# EAGLE design T04_Main_Board (EAGLE 7.1.0)
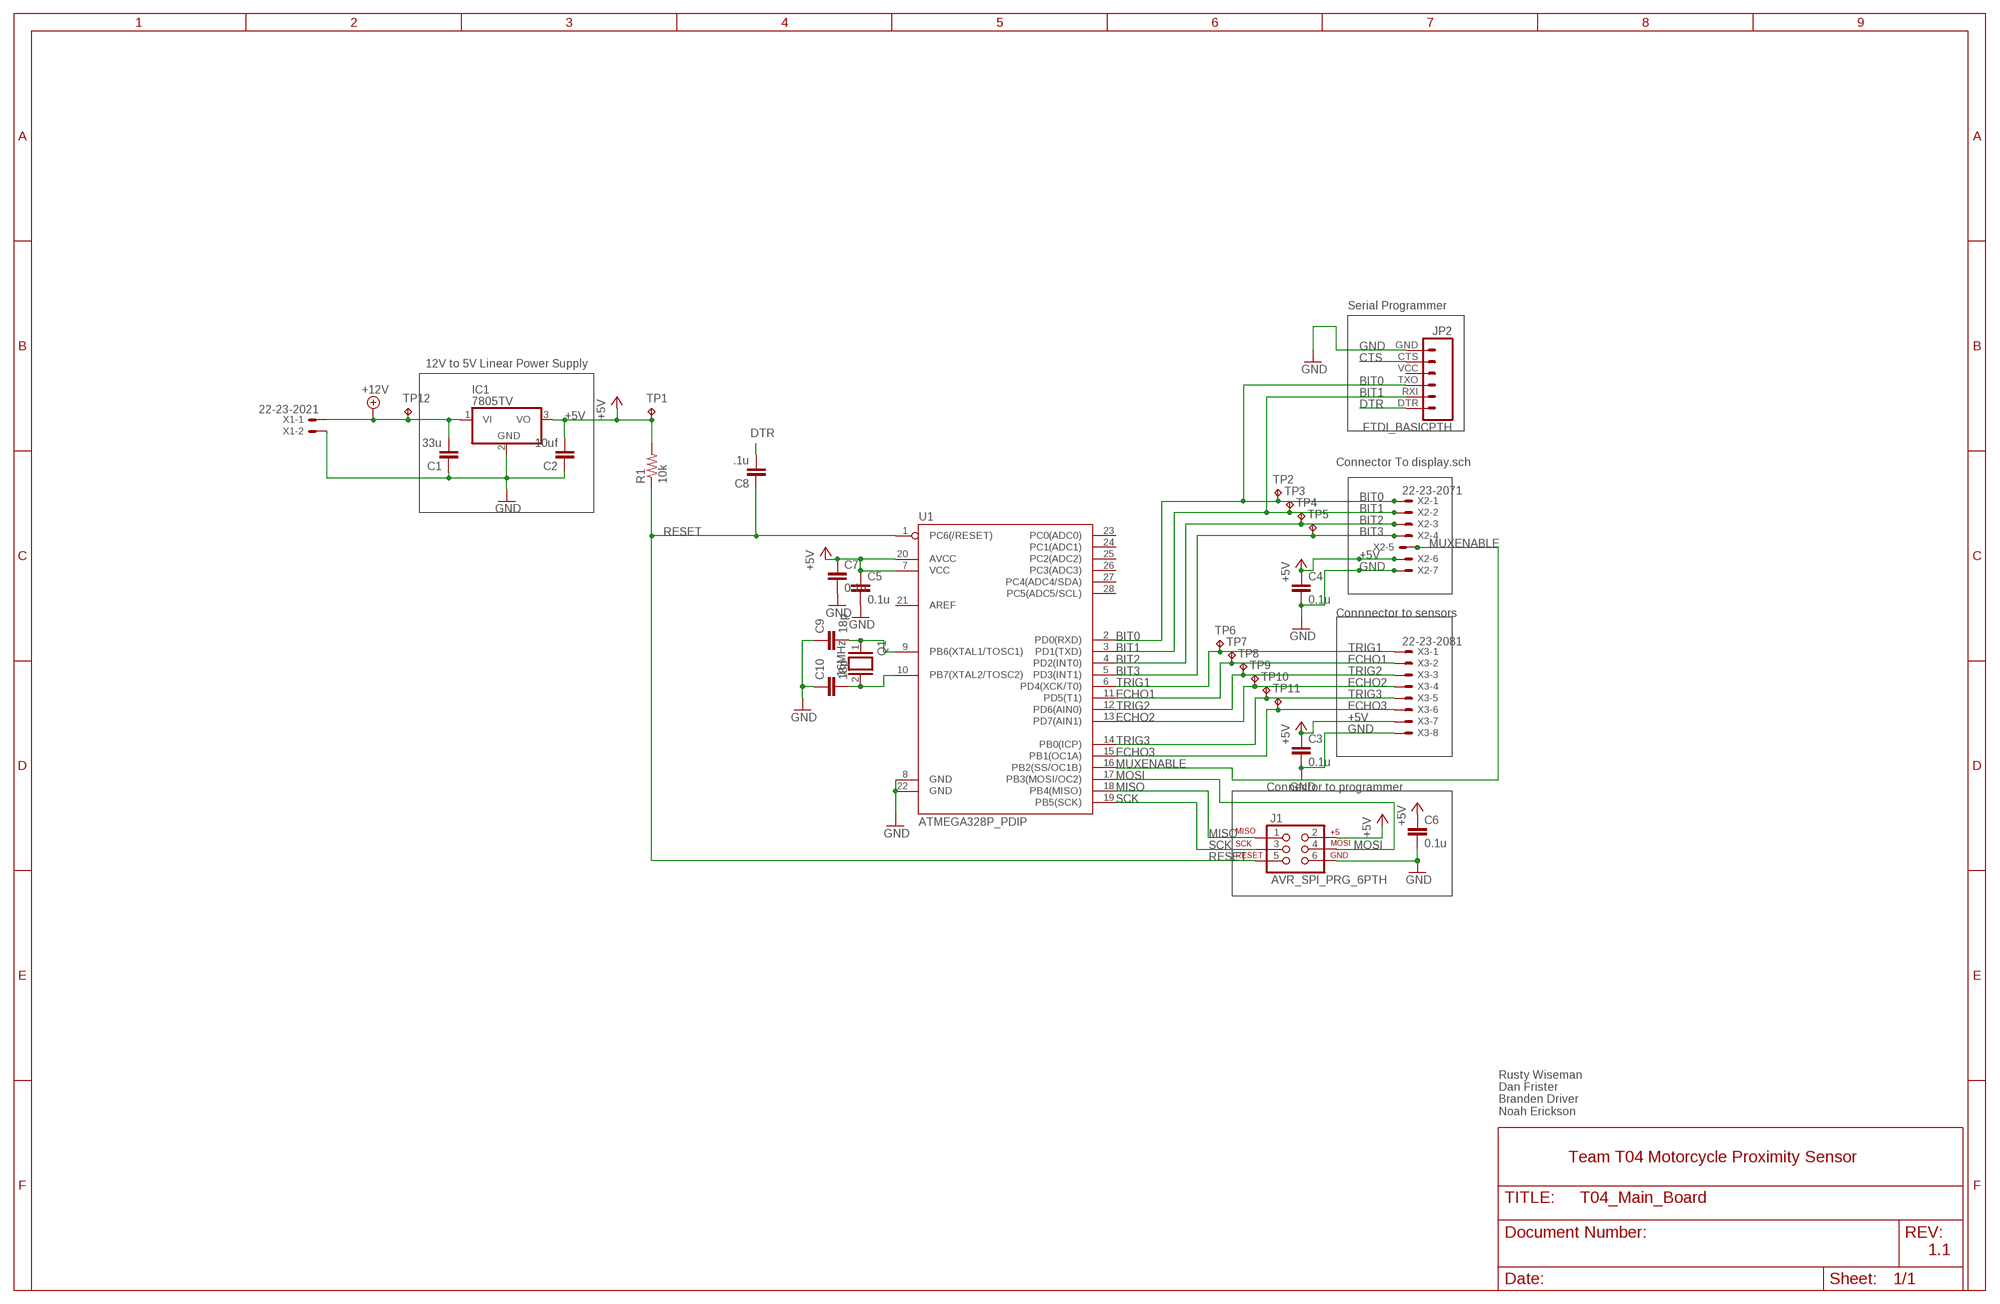
[diagram p0: schematic, sheet 1]

## Parts
C1  33u  C-EUC1206  [C1206]
C2  10uf  C-EUC1206  [C1206]
C3  0.1u  C-EUC1206  [C1206]
C4  0.1u  C-EUC1206  [C1206]
C5  0.1u  C-EUC1206  [C1206]
C6  0.1u  C-EUC1206  [C1206]
C7  0.1u  C-EUC1206  [C1206]
C8  .1u  C-EUC1206  [C1206]
C9  18p  C-EUC1206  [C1206]
C10  18p  C-EUC1206  [C1206]
IC1  7805TV  [TO220V]
J1  AVR_SPI_PRG_6PTH  [2X3]
JP2  FTDI_BASICPTH  [FTDI_BASIC]
Q1  16MHz  XTAL/S  [QS]
R1  10k  R-US_R1206  [R1206]
TP1  TPB1,27  [B1,27]
TP2  TPB1,27  [B1,27]
TP3  TPB1,27  [B1,27]
TP4  TPB1,27  [B1,27]
TP5  TPB1,27  [B1,27]
TP6  TPB1,27  [B1,27]
TP7  TPB1,27  [B1,27]
TP8  TPB1,27  [B1,27]
TP9  TPB1,27  [B1,27]
TP10  TPB1,27  [B1,27]
TP11  TPB1,27  [B1,27]
TP12  TPB1,27  [B1,27]
U1  ATMEGA328P_PDIP  [DIL28-3]
X1  22-23-2021  [22-23-2021]
X2  22-23-2071  [22-23-2071]
X3  22-23-2081  [22-23-2081]

## Nets
+5V: C2.2 C3.1 C4.1 C5.1 C6.1 C7.1 IC1.3(VO) J1.2 R1.2 TP1.TP U1.7(VCC) U1.20(AVCC) X2.6 X3.7
+12V: C1.2 IC1.1(VI) TP12.TP X1.1
BIT0: JP2.TXO TP2.TP U1.2(PD0(RXD)) X2.1
BIT1: JP2.RXI TP3.TP U1.3(PD1(TXD)) X2.2
BIT2: TP4.TP U1.4(PD2(INT0)) X2.3
BIT3: TP5.TP U1.5(PD3(INT1)) X2.4
CTS: JP2.CTS
DTR: C8.2 JP2.DTR
ECHO1: TP7.TP U1.11(PD5(T1)) X3.2
ECHO2: TP9.TP U1.13(PD7(AIN1)) X3.4
ECHO3: TP11.TP U1.15(PB1(OC1A)) X3.6
GND: C1.1 C2.1 C3.2 C4.2 C5.2 C6.2 C7.2 C9.1 C10.1 IC1.2(GND) J1.6 JP2.GND U1.8(GND) U1.22(GND) X1.2 X2.7 X3.8
MISO: J1.1 U1.18(PB4(MISO))
MOSI: J1.4 U1.17(PB3(MOSI/OC2))
MUXENABLE: U1.16(PB2(SS/OC1B)) X2.5
N$2: C10.2 Q1.2 U1.10(PB7(XTAL2/TOSC2))
N$3: C9.2 Q1.1 U1.9(PB6(XTAL1/TOSC1))
RESET: C8.1 J1.5 R1.1 U1.1(PC6(/RESET))
SCK: J1.3 U1.19(PB5(SCK))
TRIG1: TP6.TP U1.6(PD4(XCK/T0)) X3.1
TRIG2: TP8.TP U1.12(PD6(AIN0)) X3.3
TRIG3: TP10.TP U1.14(PB0(ICP)) X3.5
Unconnected: JP2.VCC U1.21(AREF) U1.23(PC0(ADC0)) U1.24(PC1(ADC1)) U1.25(PC2(ADC2)) U1.26(PC3(ADC3)) U1.27(PC4(ADC4/SDA)) U1.28(PC5(ADC5/SCL))

## Notes on the sheet
- Serial Programmer
- 12V to 5V Linear Power Supply
- Connector To display.sch
- Connnector to sensors
- Connector to programmer
- Rusty Wiseman
  Dan Frister
  Branden Driver
  Noah Erickson
- Team T04 Motorcycle Proximity Sensor
- 1.1

## Library data of the parts
C1-C10 = rcl:C-EU: CAPACITOR, European symbol
IC1 = linear:78*: Positive VOLTAGE REGULATOR Source: http://cache.national.com/ds/LM/LM78L05.pdf http://www.fairchildsemi.com/ds/LM/LM7805.pdf
J1 = SparkFun-Connectors:AVR_SPI_PRG_6: AVR ISP 6 Pin This is the reduced ISP connector for AVR programming. Common on Arduino. This footprint will take up less PCB space and can be used with a 10-pin to 6-pin adapter such as SKU: BOB-08508 **Special note about "TEST_POINT" package. The stop mask is on the top side, so if you want your programming test points to be on the bottom of your board, make sure to place this package on the bottom side of the board. This also ensure that the orientation to program from the bottom side will be correct.
JP2 = SparkFun-Connectors:FTDI_BASIC: FTDI Basic header with labels
Q1 = special:XTAL/S: CRYSTAL
R1 = rcl:R-US_: RESISTOR, American symbol
TP1-TP12 = testpad:TP: Test pad
U1 = SparkFun-DigitalIC:ATMEGA328P_PDIP: uC used in the Arduino 32kb flash, 1k EEPROM, 2k SRAM This is the through-hole version of this chip.
X1 = con-molex:22-23-2021: .100" (2.54mm) Center Header - 2 Pin; MF: MOLEX; MPN: 22-23-2021; OC_FARNELL: 1462926; OC_NEWARK: 25C3832
X2 = con-molex:22-23-2071: .100" (2.54mm) Center Header - 7 Pin; MF: MOLEX; MPN: 22-23-2071; OC_FARNELL: 1654534; OC_NEWARK: 56H0445
X3 = con-molex:22-23-2081: .100" (2.54mm) Center Header - 8 Pin; MF: MOLEX; MPN: 22-23-2081; OC_FARNELL: 1756826; OC_NEWARK: 01C7592

## Board
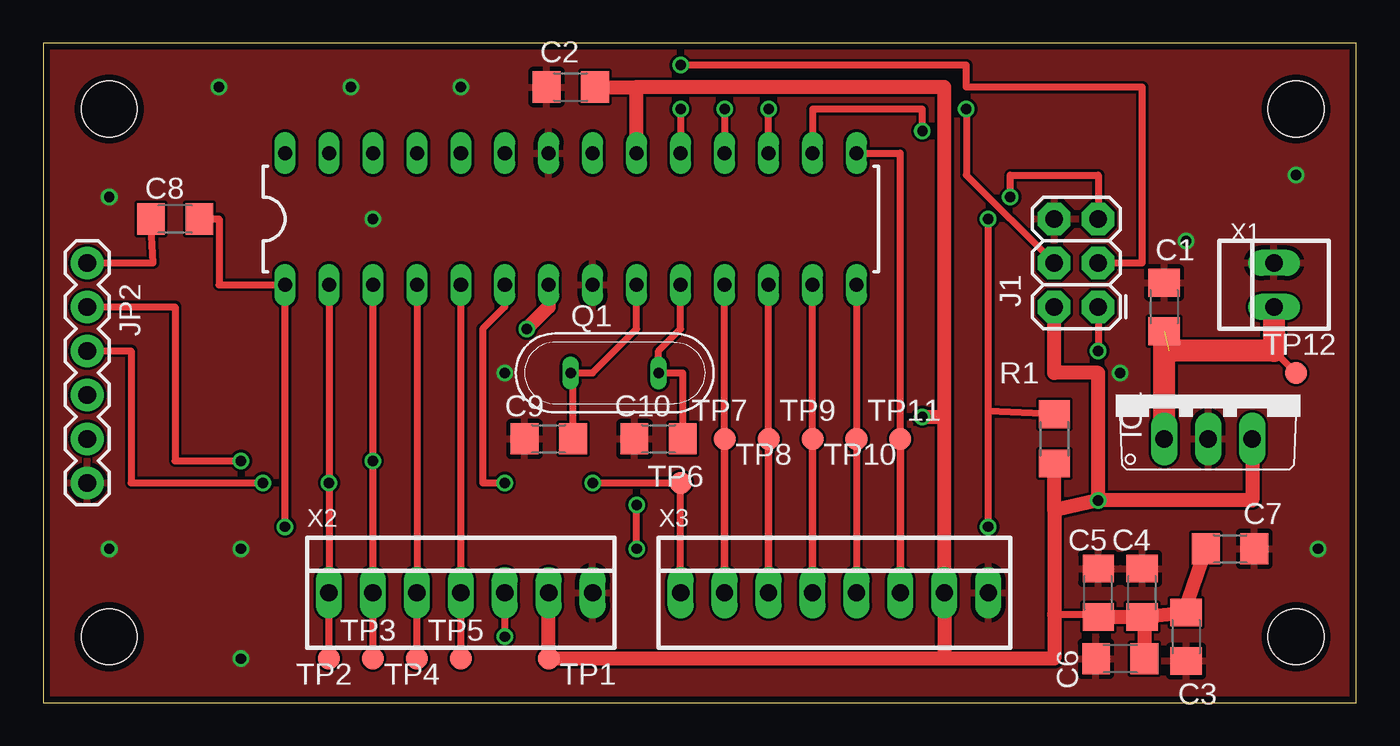
[diagram p1: board, top side]
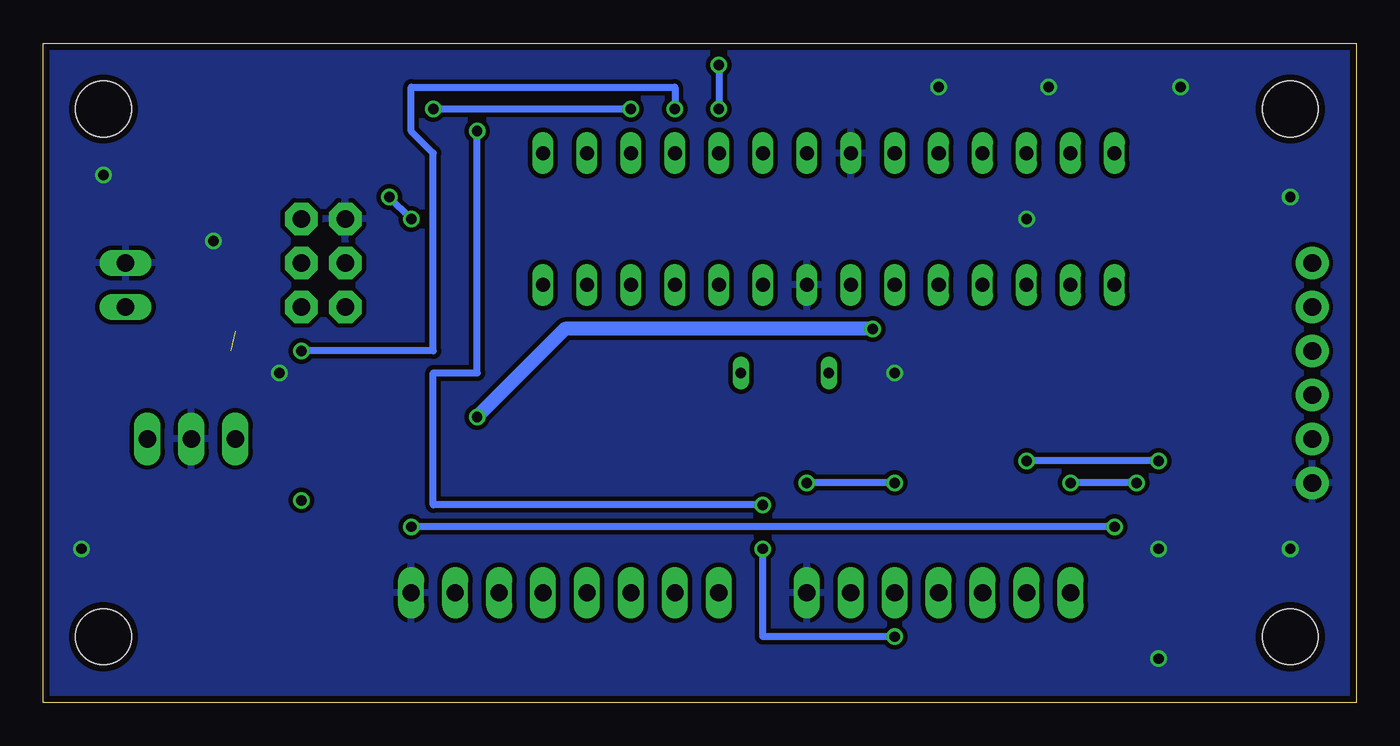
[diagram p2: board, bottom side, seen from below]

Size 75.87 x 38.09 mm. Coordinates in mm from the lower left corner, seen from the top.
Outline: 0,0 75.87,0 75.87,38.09 0,38.09 0,0
Copper layers (1*16): Top 0.0356mm / dielectric 1.5011mm / Bottom 0.0356mm
Design rules "OSH-Park-2-layer": minimum track width 6mil, minimum drill 13mil, track to track 6mil, track to pad 6mil, pad to pad 6mil, via to via 6mil, smd to smd 6mil, copper to edge 15mil, drill to drill 6mil, minimum pad ring 7mil, minimum via ring 7mil, stop-mask expansion 3mil, vias tented up to drill 0mil, thermal gap 10mil
Holes 3.2 mm at 3.81,3.81 72.39,3.81 72.39,34.29 3.81,34.29

### Footprints (pad centres in the part's own frame; a part is rotated, then mirrored left to right if it is on the bottom)
C1206 = smd 1.6 x 1.8: 1 -1.4,0; 2 1.4,0
TO220V = drill 1.016 long: 1 -2.54,-2.54; 2 0,-2.54; 3 2.54,-2.54
2X3 = drill 1.016 pad 1.88 octagon: 1 0,0; 2 0,2.54; 3 2.54,0; 4 2.54,2.54; 5 5.08,0; 6 5.08,2.54
FTDI_BASIC = drill 1.016 pad 1.88: CTS 10.16,0; DTR 0,0; GND 12.7,0; RXI 2.54,0; TXO 5.08,0; VCC 7.62,0
QS = drill 0.61 long: 1 -2.54,0; 2 2.54,0
R1206 = smd 1.6 x 1.803: 1 -1.422,0; 2 1.422,0
B1,27 = smd 1.27 x 1.27: TP 0,0
DIL28-3 = drill 0.813 long: 1 -16.51,-3.81; 2 -13.97,-3.81; 3 -11.43,-3.81; 4 -8.89,-3.81; 5 -6.35,-3.81; 6 -3.81,-3.81; 7 -1.27,-3.81; 8 1.27,-3.81; 9 3.81,-3.81; 10 6.35,-3.81; 11 8.89,-3.81; 12 11.43,-3.81; 13 13.97,-3.81; 14 16.51,-3.81; 15 16.51,3.81; 16 13.97,3.81; 17 11.43,3.81; 18 8.89,3.81; 19 6.35,3.81; 20 3.81,3.81; 21 1.27,3.81; 22 -1.27,3.81; 23 -3.81,3.81; 24 -6.35,3.81; 25 -8.89,3.81; 26 -11.43,3.81; 27 -13.97,3.81; 28 -16.51,3.81
22-23-2021 = drill 1 long: 1 -1.27,0; 2 1.27,0
22-23-2071 = drill 1 long: 1 -7.62,0; 2 -5.08,0; 3 -2.54,0; 4 0,0; 5 2.54,0; 6 5.08,0; 7 7.62,0
22-23-2081 = drill 1 long: 1 -8.89,0; 2 -6.35,0; 3 -3.81,0; 4 -1.27,0; 5 1.27,0; 6 3.81,0; 7 6.35,0; 8 8.89,0

### Placement (x,y rotation side)
C1  64.77,22.86 270 top
C2  30.48,35.56 0 top
C3  66.04,3.81 270 top
C4  63.5,6.35 90 top
C5  60.96,6.35 90 top
C6  62.23,2.54 180 top
C7  68.58,8.89 0 top
C8  7.62,27.94 180 top
C9  29.21,15.24 0 top
C10  35.56,15.24 0 top
IC1  67.31,17.78 0 top
J1  60.96,22.86 90 top
JP2  2.54,25.4 270 top
Q1  33.02,19.05 0 top
R1  58.42,15.24 270 top
TP1  29.21,2.54 0 top
TP2  16.51,2.54 0 top
TP3  19.05,2.54 0 top
TP4  21.59,2.54 0 top
TP5  24.13,2.54 0 top
TP6  36.83,12.7 0 top
TP7  39.37,15.24 0 top
TP8  41.91,15.24 0 top
TP9  44.45,15.24 0 top
TP10  46.99,15.24 0 top
TP11  49.53,15.24 0 top
TP12  72.39,19.05 0 top
U1  30.48,27.94 0 top
X1  71.12,24.13 90 top
X2  24.13,6.35 0 top
X3  45.72,6.35 0 top

### Tracks (layer width: path | path; a pad name or v marks a point on that pad's centre or on a via)
+5V  (via drill 0.6)
  Top 0.406: C5.1 60.96,5.08 58.42,5.08 | 65.91,5.21 C3.1
  Top 0.813: IC1.3 69.85,11.69 v60.96,11.69 | 52.07,16.51 X3.7 52.07,2.54 | 52.07,16.51 52.07,35.56 34.29,35.56 | v60.96,11.69 60.96,19.05 58.42,19.05 J1.2 | X2.6 TP1.TP 52.07,2.54 | 58.42,11.12 58.42,5.08 58.42,2.54 52.07,2.54 | U1.20 34.29,35.56 | U1.7 29.21,22.86 v27.94,21.59 | v50.8,16.51 52.07,16.51 | v60.96,11.69 58.42,11.12 | 58.42,11.12 R1.2 | C5.1 C4.1 63.63,4.95 | 63.63,4.95 C6.1 | 63.63,4.95 C3.1 | C7.1 65.91,5.21 | C2.2 34.29,35.56
  Bottom 0.813: v27.94,21.59 45.72,21.59 v50.8,16.51
+12V  (1 unrouted)
  Top 0.406: 71.12,20.32 TP12.TP
  Top 1.27: X1.1 71.12,20.32 65.05,20.32 | IC1.1 C1.2
BIT0  (via drill 0.6)
  Top 0.406: TP2.TP X2.1 v16.51,12.7 U1.2 | JP2.TXO 5.08,20.32 5.08,12.7 v12.7,12.7
  Bottom 0.406: v12.7,12.7 v16.51,12.7
BIT1  (via drill 0.6)
  Top 0.406: TP3.TP X2.2 v19.05,13.97 U1.3 | JP2.RXI 7.62,22.86 7.62,13.97 v11.43,13.97
  Bottom 0.406: v11.43,13.97 v19.05,13.97
BIT2
  Top 0.406: U1.4 X2.3 TP4.TP
BIT3
  Top 0.406: U1.5 X2.4 TP5.TP
DTR
  Top 0.406: JP2.DTR 6.35,25.4 C8.2
ECHO1
  Top 0.406: TP7.TP X3.2 U1.11
ECHO2
  Top 0.406: U1.13 X3.4 TP9.TP
ECHO3
  Top 0.406: U1.15 49.53,31.75 X3.6 TP11.TP
GND  (via drill 0.6)
  other vias: 3.81,8.89 11.43,8.89 11.43,2.54 66.04,26.67 72.39,30.48 10.16,35.56 3.81,29.21 62.23,19.05 17.78,35.56 24.13,35.56 19.05,27.94 73.66,8.89 26.67,19.05
  pour Top: 0,0 100.33,0 100.33,80.01 0,80.01
  pour Bottom (isolate 0.254): 0,0 100.33,0 100.33,80.01 0,80.01
MISO  (via drill 0.6)
  Top 0.406: v39.37,34.29 U1.18 | J1.1 v60.96,20.32
  Bottom 0.406: v39.37,34.29 39.37,35.56 54.61,35.56 54.61,33.02 53.34,31.75 53.34,20.32 v60.96,20.32
MOSI  (via drill 0.6)
  Top 0.406: U1.17 v41.91,34.29 | v53.34,34.29 53.34,30.48 J1.4
  Bottom 0.406: v41.91,34.29 v53.34,34.29
MUXENABLE  (via drill 0.6)
  Top 0.406: X2.5 v26.67,3.81 | v34.29,8.89 v34.29,11.43 | v50.8,33.02 50.8,34.29 44.45,34.29 U1.16
  Bottom 0.406: v26.67,3.81 34.29,3.81 v34.29,8.89 | v34.29,11.43 53.34,11.43 53.34,19.05 50.8,19.05 v50.8,33.02
N$2
  Top 0.406: U1.10 36.83,21.59 35.56,20.32 Q1.2 36.96,19.05 C10.2
N$3
  Top 0.406: U1.9 34.29,21.59 31.75,19.05 Q1.1 30.61,19.05 C9.2
RESET  (via drill 0.6)
  Top 0.406: C8.1 10.16,27.94 10.16,24.13 U1.1 v13.97,10.16 | R1.1 54.61,16.82 | 54.61,16.82 v54.61,27.94 | J1.5 60.96,30.48 55.88,30.48 v55.88,29.21 | v54.61,10.16 54.61,16.82
  Bottom 0.406: v54.61,27.94 v55.88,29.21 | v13.97,10.16 v54.61,10.16
SCK  (via drill 0.6)
  Top 0.406: J1.3 63.5,25.4 63.5,35.56 53.34,35.56 53.34,36.83 v36.83,36.83 | v36.83,34.29 U1.19
  Bottom 0.406: v36.83,36.83 v36.83,34.29
TRIG1  (via drill 0.6)
  Top 0.406: v31.75,12.7 TP6.TP X3.1 | U1.6 26.67,22.86 25.4,21.59 25.4,12.7 v26.67,12.7
  Bottom 0.406: v26.67,12.7 v31.75,12.7
TRIG2
  Top 0.406: U1.12 X3.3 TP8.TP
TRIG3
  Top 0.406: U1.14 X3.5 TP10.TP

### Text on the board
tValues: T04 Rev 1.3 / November 9th, 2014 / B. Driver N.Erickson / D. Frister R.Wiseman